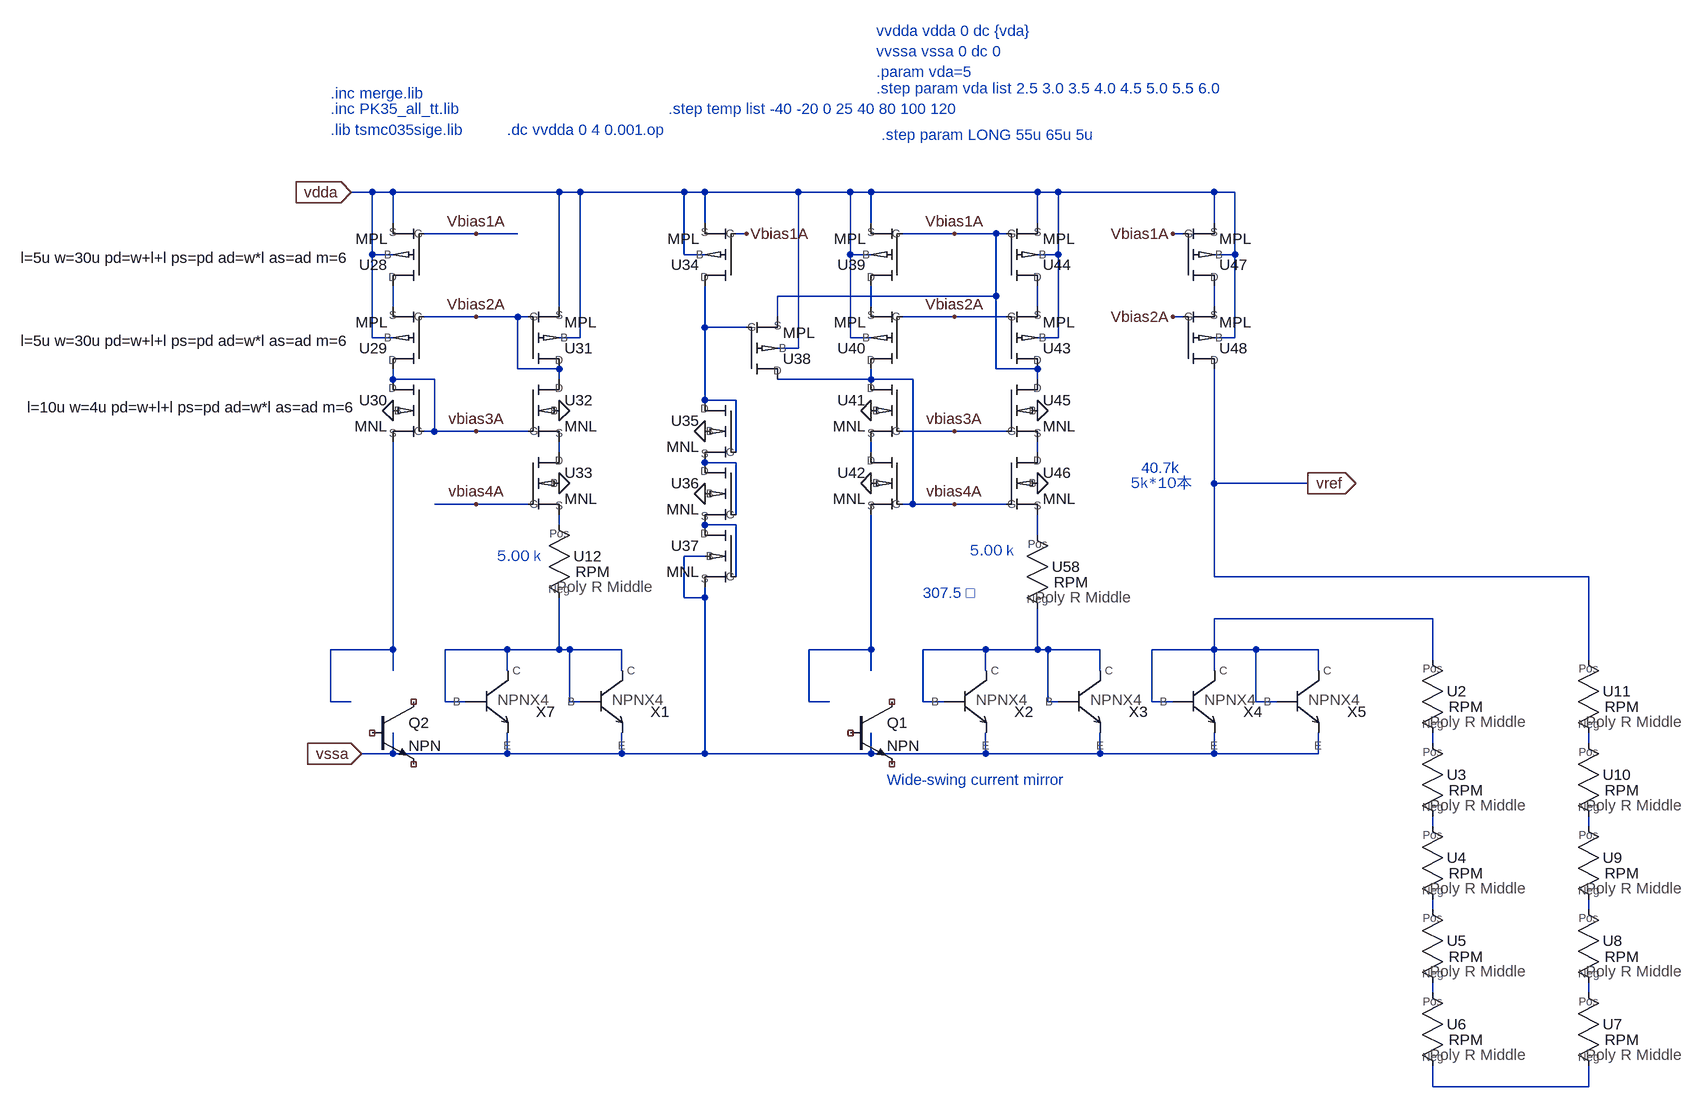
[diagram p0: schematic BGR_5V.asc]
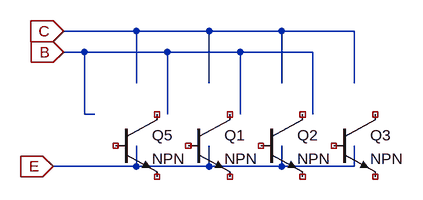
[diagram p1: sub-circuit npn4.asc]
BGR_5V.asc, the LTspice schematic file:
Version 4
SHEET 1 4860 5172
WIRE 816 496 784 496
WIRE 848 496 816 496
WIRE 1104 496 848 496
WIRE 1136 496 1104 496
WIRE 1296 496 1136 496
WIRE 1328 496 1296 496
WIRE 1472 496 1328 496
WIRE 1552 496 1472 496
WIRE 1584 496 1552 496
WIRE 1840 496 1584 496
WIRE 1872 496 1840 496
WIRE 2112 496 1872 496
WIRE 2144 496 2112 496
WIRE 848 544 848 496
WIRE 1328 544 1328 496
WIRE 1584 544 1584 496
WIRE 1840 544 1840 496
WIRE 2112 544 2112 496
WIRE 976 560 896 560
WIRE 1040 560 976 560
WIRE 1392 560 1376 560
WIRE 1712 560 1632 560
WIRE 1776 560 1712 560
WIRE 1792 560 1776 560
WIRE 2064 560 2048 560
WIRE 816 592 816 496
WIRE 848 592 816 592
WIRE 1296 592 1296 496
WIRE 1328 592 1296 592
WIRE 1552 592 1552 496
WIRE 1584 592 1552 592
WIRE 1872 592 1872 496
WIRE 1872 592 1840 592
WIRE 2144 592 2144 496
WIRE 2144 592 2112 592
WIRE 1776 656 1776 560
WIRE 1776 656 1440 656
WIRE 848 672 848 640
WIRE 1104 672 1104 496
WIRE 1584 672 1584 640
WIRE 1840 672 1840 640
WIRE 2112 672 2112 640
WIRE 976 688 896 688
WIRE 1040 688 976 688
WIRE 1056 688 1040 688
WIRE 1440 688 1440 656
WIRE 1712 688 1632 688
WIRE 1792 688 1712 688
WIRE 2064 688 2048 688
WIRE 1328 704 1328 640
WIRE 1392 704 1328 704
WIRE 816 720 816 592
WIRE 848 720 816 720
WIRE 1136 720 1136 496
WIRE 1136 720 1104 720
WIRE 1552 720 1552 592
WIRE 1584 720 1552 720
WIRE 1872 720 1872 592
WIRE 1872 720 1840 720
WIRE 2144 720 2144 592
WIRE 2144 720 2112 720
WIRE 1472 736 1472 496
WIRE 1472 736 1440 736
WIRE 1040 768 1040 688
WIRE 1104 768 1040 768
WIRE 1776 768 1776 656
WIRE 1840 768 1840 752
WIRE 1840 768 1776 768
WIRE 848 784 848 768
WIRE 912 784 848 784
WIRE 1104 784 1104 768
WIRE 1584 784 1584 768
WIRE 1584 784 1440 784
WIRE 1648 784 1584 784
WIRE 1840 784 1840 768
WIRE 1328 816 1328 704
WIRE 1376 816 1328 816
WIRE 912 864 912 784
WIRE 912 864 896 864
WIRE 976 864 912 864
WIRE 1056 864 976 864
WIRE 1712 864 1632 864
WIRE 1792 864 1712 864
WIRE 1104 896 1104 880
WIRE 1376 896 1376 816
WIRE 1584 896 1584 880
WIRE 1840 896 1840 880
WIRE 1376 912 1328 912
WIRE 2112 944 2112 768
WIRE 2256 944 2112 944
WIRE 976 976 912 976
WIRE 1056 976 976 976
WIRE 1648 976 1648 784
WIRE 1648 976 1632 976
WIRE 1712 976 1648 976
WIRE 1792 976 1712 976
WIRE 1376 992 1376 912
WIRE 1104 1008 1104 992
WIRE 1376 1008 1328 1008
WIRE 1840 1024 1840 992
WIRE 1328 1056 1296 1056
WIRE 1376 1088 1376 1008
WIRE 2112 1088 2112 944
WIRE 2688 1088 2112 1088
WIRE 1296 1120 1296 1056
WIRE 1328 1120 1328 1104
WIRE 1328 1120 1296 1120
WIRE 2448 1152 2112 1152
WIRE 848 1200 848 880
WIRE 848 1200 752 1200
WIRE 1024 1200 928 1200
WIRE 1104 1200 1104 1120
WIRE 1104 1200 1024 1200
WIRE 1120 1200 1104 1200
WIRE 1200 1200 1120 1200
WIRE 1584 1200 1584 992
WIRE 1584 1200 1488 1200
WIRE 1760 1200 1664 1200
WIRE 1840 1200 1840 1136
WIRE 1840 1200 1760 1200
WIRE 1856 1200 1840 1200
WIRE 1936 1200 1856 1200
WIRE 2112 1200 2112 1152
WIRE 2112 1200 2016 1200
WIRE 2176 1200 2112 1200
WIRE 2272 1200 2176 1200
WIRE 2448 1216 2448 1152
WIRE 2688 1216 2688 1088
WIRE 848 1232 848 1200
WIRE 1024 1232 1024 1200
WIRE 1200 1232 1200 1200
WIRE 1584 1232 1584 1200
WIRE 1760 1232 1760 1200
WIRE 1936 1232 1936 1200
WIRE 2112 1232 2112 1200
WIRE 2272 1232 2272 1200
WIRE 752 1280 752 1200
WIRE 784 1280 752 1280
WIRE 928 1280 928 1200
WIRE 960 1280 928 1280
WIRE 1120 1280 1120 1200
WIRE 1136 1280 1120 1280
WIRE 1488 1280 1488 1200
WIRE 1520 1280 1488 1280
WIRE 1664 1280 1664 1200
WIRE 1696 1280 1664 1280
WIRE 1856 1280 1856 1200
WIRE 1872 1280 1856 1280
WIRE 2016 1280 2016 1200
WIRE 2048 1280 2016 1280
WIRE 2176 1280 2176 1200
WIRE 2208 1280 2176 1280
WIRE 2448 1344 2448 1328
WIRE 2688 1344 2688 1328
WIRE 848 1360 848 1328
WIRE 848 1360 800 1360
WIRE 1024 1360 1024 1328
WIRE 1024 1360 848 1360
WIRE 1200 1360 1200 1328
WIRE 1200 1360 1024 1360
WIRE 1328 1360 1328 1120
WIRE 1328 1360 1200 1360
WIRE 1584 1360 1584 1328
WIRE 1584 1360 1328 1360
WIRE 1760 1360 1760 1328
WIRE 1760 1360 1584 1360
WIRE 1936 1360 1936 1328
WIRE 1936 1360 1760 1360
WIRE 2112 1360 2112 1328
WIRE 2112 1360 1936 1360
WIRE 2272 1360 2272 1328
WIRE 2272 1360 2112 1360
WIRE 2448 1472 2448 1456
WIRE 2688 1472 2688 1456
WIRE 2448 1600 2448 1584
WIRE 2688 1600 2688 1584
WIRE 2448 1728 2448 1712
WIRE 2688 1728 2688 1712
WIRE 2448 1872 2448 1840
WIRE 2688 1872 2688 1840
WIRE 2688 1872 2448 1872
FLAG 1712 560 Vbias1A
FLAG 1392 560 Vbias1A
FLAG 1712 688 Vbias2A
FLAG 2048 560 Vbias1A
FLAG 2048 688 Vbias2A
FLAG 784 496 vdda
IOPIN 784 496 In
FLAG 800 1360 vssa
IOPIN 800 1360 In
FLAG 2256 944 vref
IOPIN 2256 944 Out
FLAG 976 560 Vbias1A
FLAG 976 688 Vbias2A
FLAG 1712 864 vbias3A
FLAG 1712 976 vbias4A
FLAG 976 976 vbias4A
FLAG 976 864 vbias3A
FLAG 848 832 0
FLAG 1104 832 0
FLAG 1104 944 0
FLAG 1328 864 0
FLAG 1328 960 0
FLAG 1584 832 0
FLAG 1584 944 0
FLAG 1840 832 0
FLAG 1840 944 0
SYMBOL NPN 816 1280 R0
SYMATTR InstName Q2
SYMBOL MPL 864 592 R180
WINDOW 39 78 -5 Left 2
SYMATTR SpiceLine l=5u w=30u pd=w+l+l ps=pd ad=w*l as=ad m=6
SYMATTR InstName U28
SYMBOL MPL 864 720 R180
WINDOW 39 78 -5 Left 2
SYMATTR SpiceLine l=5u w=30u pd=w+l+l ps=pd ad=w*l as=ad m=6
SYMATTR InstName U29
SYMBOL MNN 864 832 M0
WINDOW 39 68 -5 Left 2
SYMATTR SpiceLine l=10u w=4u pd=w+l+l ps=pd ad=w*l as=ad m=6
SYMATTR InstName U30
SYMATTR Value MNL
SYMBOL MPL 1088 720 M180
SYMATTR SpiceLine l=5u w=6u pd=w+l+l ps=pd ad=w*l as=ad m=6
SYMATTR InstName U31
SYMBOL MNN 1088 832 R0
SYMATTR SpiceLine l=10u w=20u pd=w+l+l ps=pd ad=w*l as=ad m=6
SYMATTR InstName U32
SYMATTR Value MNL
SYMBOL MNN 1088 944 R0
SYMATTR SpiceLine l=10u w=10u pd=w+l+l ps=pd ad=w*l as=ad m=1
SYMATTR InstName U33
SYMATTR Value MNL
SYMBOL MPL 1344 592 R180
SYMATTR SpiceLine l=2u w=30u pd=w+l+l ps=pd ad=w*l as=ad m=1
SYMATTR InstName U34
SYMBOL MNN 1344 864 M0
SYMATTR SpiceLine l=10u w=10u pd=w+l+l ps=pd ad=w*l as=ad m=1
SYMATTR InstName U35
SYMATTR Value MNL
SYMBOL MNN 1344 960 M0
SYMATTR SpiceLine l=10u w=10u pd=w+l+l ps=pd ad=w*l as=ad m=1
SYMATTR InstName U36
SYMATTR Value MNL
SYMBOL MNN 1344 1056 M0
SYMATTR SpiceLine l=10u w=10u pd=w+l+l ps=pd ad=w*l as=ad m=1
SYMATTR InstName U37
SYMATTR Value MNL
SYMBOL MPL 1424 736 M180
SYMATTR SpiceLine l=5u w=30u pd=w+l+l ps=pd ad=w*l as=ad m=6
SYMATTR InstName U38
SYMBOL MPL 1600 592 R180
SYMATTR SpiceLine l=5u w=30u pd=w+l+l ps=pd ad=w*l as=ad m=6
SYMATTR InstName U39
SYMBOL MPL 1600 720 R180
SYMATTR SpiceLine l=5u w=30.1u pd=w+l+l ps=pd ad=w*l as=ad m=6
SYMATTR InstName U40
SYMBOL MNN 1600 832 M0
SYMATTR SpiceLine l=10u w=20.1u pd=w+l+l ps=pd ad=w*l as=ad m=6
SYMATTR InstName U41
SYMATTR Value MNL
SYMBOL MNN 1600 944 M0
SYMATTR SpiceLine l=10u w=20u pd=w+l+l ps=pd ad=w*l as=ad m=6
SYMATTR InstName U42
SYMATTR Value MNL
SYMBOL MPL 1824 720 M180
SYMATTR SpiceLine l=5u w=30u pd=w+l+l ps=pd ad=w*l as=ad m=6
SYMATTR InstName U43
SYMBOL MPL 1824 592 M180
SYMATTR SpiceLine l=5u w=30u pd=w+l+l ps=pd ad=w*l as=ad m=6
SYMATTR InstName U44
SYMBOL MNN 1824 832 R0
SYMATTR SpiceLine l=10u w=20u pd=w+l+l ps=pd ad=w*l as=ad m=6
SYMATTR InstName U45
SYMATTR Value MNL
SYMBOL MNN 1824 944 R0
SYMATTR SpiceLine l=10u w=20u pd=w+l+l ps=pd ad=w*l as=ad m=6
SYMATTR InstName U46
SYMATTR Value MNL
SYMBOL MPL 2096 592 M180
SYMATTR SpiceLine l=5u w=30u pd=w+l+l ps=pd ad=w*l as=ad m=6
SYMATTR InstName U47
SYMBOL MPL 2096 720 M180
SYMATTR SpiceLine l=5u w=30u pd=w+l+l ps=pd ad=w*l as=ad m=6
SYMATTR InstName U48
SYMBOL RPM 1104 1056 R0
WINDOW 3 25 24 Left 2
SYMATTR InstName U12
SYMATTR SpiceLine L=77.0u W=5.0u
SYMBOL RPM 1840 1072 R0
WINDOW 3 25 24 Left 2
SYMATTR InstName U58
SYMATTR SpiceLine L=77.0u W=5.0u
SYMBOL RPM 2448 1264 R0
WINDOW 3 25 24 Left 2
SYMATTR InstName U2
SYMATTR SpiceLine L=77.0u W=5.0u
SYMBOL RPM 2448 1392 R0
WINDOW 3 25 24 Left 2
SYMATTR InstName U3
SYMATTR SpiceLine L=77.0u W=5.0u
SYMBOL RPM 2448 1520 R0
WINDOW 3 25 24 Left 2
SYMATTR InstName U4
SYMATTR SpiceLine L=77.0u W=5.0u
SYMBOL RPM 2448 1648 R0
WINDOW 3 25 24 Left 2
SYMATTR InstName U5
SYMATTR SpiceLine L=77.0u W=5.0u
SYMBOL RPM 2448 1776 R0
WINDOW 3 25 24 Left 2
SYMATTR InstName U6
SYMATTR SpiceLine L=77.0u W=5.0u
SYMBOL RPM 2688 1776 R0
WINDOW 3 25 24 Left 2
SYMATTR InstName U7
SYMATTR SpiceLine L=77.0u W=5.0u
SYMBOL RPM 2688 1648 R0
WINDOW 3 25 24 Left 2
SYMATTR InstName U8
SYMATTR SpiceLine L=77.0u W=5.0u
SYMBOL RPM 2688 1520 R0
WINDOW 3 25 24 Left 2
SYMATTR InstName U9
SYMATTR SpiceLine L=77.0u W=5.0u
SYMBOL RPM 2688 1392 R0
WINDOW 3 25 24 Left 2
SYMATTR InstName U10
SYMATTR SpiceLine L=77.0u W=5.0u
SYMBOL RPM 2688 1264 R0
WINDOW 3 25 24 Left 2
SYMATTR InstName U11
SYMATTR SpiceLine L=77.0u W=5.0u
SYMBOL NPN4 992 1280 R0
SYMATTR InstName X7
SYMBOL NPN4 1168 1280 R0
SYMATTR InstName X1
SYMBOL NPN 1552 1280 R0
SYMATTR InstName Q1
SYMBOL NPN4 1728 1280 R0
SYMATTR InstName X2
SYMBOL NPN4 1904 1280 R0
SYMATTR InstName X3
SYMBOL NPN4 2080 1280 R0
SYMATTR InstName X4
SYMBOL NPN4 2240 1280 R0
SYMATTR InstName X5
TEXT 752 400 Left 2 ;.lib tsmc035sige.lib
TEXT 1592 248 Left 2 ;vvdda vdda 0 dc {vda}\nvvssa vssa 0 dc 0\n.param vda=5
TEXT 1024 400 Left 2 ;.dc vvdda 0 4 0.001
TEXT 1272 368 Left 2 ;.step temp list -40 -20 0 25 40 80 100 120
TEXT 1232 400 Left 2 ;.op
TEXT 752 368 Left 2 ;.inc PK35_all_tt.lib
TEXT 752 344 Left 2 ;.inc merge.lib
TEXT 1608 1400 Left 2 ;Wide-swing current mirror
TEXT 1592 336 Left 2 ;.step param vda list 2.5 3.0 3.5 4.0 4.5 5.0 5.5 6.0
TEXT 2000 920 Left 2 ;40.7k
TEXT 1984 944 Left 2 ;5k*10本
TEXT 1736 1048 Left 2 ;5.00ｋ
TEXT 1664 1112 Left 2 ;307.5 □
TEXT 1600 408 Left 2 ;.step param LONG 55u 65u 5u
TEXT 1008 1056 Left 2 ;5.00ｋ

npn4.asc, the sub-circuit schematic file:
Version 4
SHEET 1 880 1556
WIRE -800 16 -912 16
WIRE -688 16 -800 16
WIRE -576 16 -688 16
WIRE -464 16 -576 16
WIRE -880 48 -912 48
WIRE -752 48 -880 48
WIRE -640 48 -752 48
WIRE -528 48 -640 48
WIRE -800 96 -800 16
WIRE -688 96 -688 16
WIRE -576 96 -576 16
WIRE -464 96 -464 16
WIRE -880 144 -880 48
WIRE -864 144 -880 144
WIRE -752 144 -752 48
WIRE -640 144 -640 48
WIRE -528 144 -528 48
WIRE -800 224 -800 192
WIRE -800 224 -928 224
WIRE -688 224 -688 192
WIRE -688 224 -800 224
WIRE -576 224 -576 192
WIRE -576 224 -688 224
WIRE -464 224 -464 192
WIRE -464 224 -576 224
FLAG -912 16 C
IOPIN -912 16 In
FLAG -928 224 E
IOPIN -928 224 In
FLAG -912 48 B
IOPIN -912 48 In
SYMBOL NPN -832 144 R0
SYMATTR InstName Q5
SYMBOL NPN -720 144 R0
SYMATTR InstName Q1
SYMBOL NPN -608 144 R0
SYMATTR InstName Q2
SYMBOL NPN -496 144 R0
SYMATTR InstName Q3

The netlist it stands for:
* BGR_5V.asc
* Q2: NPN (symbol NPN not certain, pin order unknown); nets seen at it: 0
XU28 N001 Vbias1A vdda vdda MPL l=5u w=30u pd=w+l+l ps=pd ad=w*l as=ad m=6  ; pins D G S B
XU29 vbias3A Vbias2A N001 vdda MPL l=5u w=30u pd=w+l+l ps=pd ad=w*l as=ad m=6  ; pins D G S B
XU30 vbias3A vbias3A N014 0 MNL l=10u w=4u pd=w+l+l ps=pd ad=w*l as=ad m=6  ; pins D G S B
XU31 Vbias2A Vbias2A vdda vdda MPL l=5u w=6u pd=w+l+l ps=pd ad=w*l as=ad m=6  ; pins D G S B
XU32 Vbias2A vbias3A N006 0 MNL l=10u w=20u pd=w+l+l ps=pd ad=w*l as=ad m=6  ; pins D G S B
XU33 N006 vbias4A N010 0 MNL l=10u w=10u pd=w+l+l ps=pd ad=w*l as=ad m=1  ; pins D G S B
XU34 N005 Vbias1A vdda vdda MPL l=2u w=30u pd=w+l+l ps=pd ad=w*l as=ad m=1  ; pins D G S B
XU35 N005 N005 N009 0 MNL l=10u w=10u pd=w+l+l ps=pd ad=w*l as=ad m=1  ; pins D G S B
XU36 N009 N009 N011 0 MNL l=10u w=10u pd=w+l+l ps=pd ad=w*l as=ad m=1  ; pins D G S B
XU37 N011 N011 vssa vssa MNL l=10u w=10u pd=w+l+l ps=pd ad=w*l as=ad m=1  ; pins D G S B
XU38 vbias4A N005 Vbias1A vdda MPL l=5u w=30u pd=w+l+l ps=pd ad=w*l as=ad m=6  ; pins D G S B
XU39 N002 Vbias1A vdda vdda MPL l=5u w=30u pd=w+l+l ps=pd ad=w*l as=ad m=6  ; pins D G S B
XU40 vbias4A Vbias2A N002 vdda MPL l=5u w=30.1u pd=w+l+l ps=pd ad=w*l as=ad m=6  ; pins D G S B
XU41 vbias4A vbias3A N007 0 MNL l=10u w=20.1u pd=w+l+l ps=pd ad=w*l as=ad m=6  ; pins D G S B
XU42 N007 vbias4A N016 0 MNL l=10u w=20u pd=w+l+l ps=pd ad=w*l as=ad m=6  ; pins D G S B
XU43 Vbias1A Vbias2A N003 vdda MPL l=5u w=30u pd=w+l+l ps=pd ad=w*l as=ad m=6  ; pins D G S B
XU44 N003 Vbias1A vdda vdda MPL l=5u w=30u pd=w+l+l ps=pd ad=w*l as=ad m=6  ; pins D G S B
XU45 Vbias1A vbias3A N008 0 MNL l=10u w=20u pd=w+l+l ps=pd ad=w*l as=ad m=6  ; pins D G S B
XU46 N008 vbias4A N012 0 MNL l=10u w=20u pd=w+l+l ps=pd ad=w*l as=ad m=6  ; pins D G S B
XU47 N004 Vbias1A vdda vdda MPL l=5u w=30u pd=w+l+l ps=pd ad=w*l as=ad m=6  ; pins D G S B
XU48 vref Vbias2A N004 vdda MPL l=5u w=30u pd=w+l+l ps=pd ad=w*l as=ad m=6  ; pins D G S B
XU12 N010 N015 RPM L=77.0u W=5.0u  ; pins Pos Neg
XU58 N012 N017 RPM L=77.0u W=5.0u  ; pins Pos Neg
XU2 N013 N018 RPM L=77.0u W=5.0u  ; pins Pos Neg
XU3 N018 N020 RPM L=77.0u W=5.0u  ; pins Pos Neg
XU4 N020 N022 RPM L=77.0u W=5.0u  ; pins Pos Neg
XU5 N022 N024 RPM L=77.0u W=5.0u  ; pins Pos Neg
XU6 N024 N026 RPM L=77.0u W=5.0u  ; pins Pos Neg
XU7 N025 N026 RPM L=77.0u W=5.0u  ; pins Pos Neg
XU8 N023 N025 RPM L=77.0u W=5.0u  ; pins Pos Neg
XU9 N021 N023 RPM L=77.0u W=5.0u  ; pins Pos Neg
XU10 N019 N021 RPM L=77.0u W=5.0u  ; pins Pos Neg
XU11 vref N019 RPM L=77.0u W=5.0u  ; pins Pos Neg
XX7 N015 vssa N015 npn4
XX1 N015 vssa N015 npn4
* Q1: NPN (symbol NPN not certain, pin order unknown); nets seen at it: 0
XX2 N017 vssa N017 npn4
XX3 N017 vssa N017 npn4
XX4 N013 vssa N013 npn4
XX5 N013 vssa N013 npn4

* block symbol definitions
.subckt npn4 B E C
* Q5: NPN (symbol NPN not certain, pin order unknown); nets seen at it: 0
* Q1: NPN (symbol NPN not certain, pin order unknown); nets seen at it: 0
* Q2: NPN (symbol NPN not certain, pin order unknown); nets seen at it: 0
* Q3: NPN (symbol NPN not certain, pin order unknown); nets seen at it: 0
.ends npn4

* .lib tsmc035sige.lib
* vvdda vdda 0 dc {vda}
* vvssa vssa 0 dc 0
* .param vda=5
* .dc vvdda 0 4 0.001
* .step temp list -40 -20 0 25 40 80 100 120
* .op
* .inc PK35_all_tt.lib
* .inc merge.lib
* Wide-swing current mirror
* .step param vda list 2.5 3.0 3.5 4.0 4.5 5.0 5.5 6.0
* 40.7k
* 5k*10本
* 5.00ｋ
* 307.5 □
* .step param LONG 55u 65u 5u
* 5.00ｋ
.backanno
.end